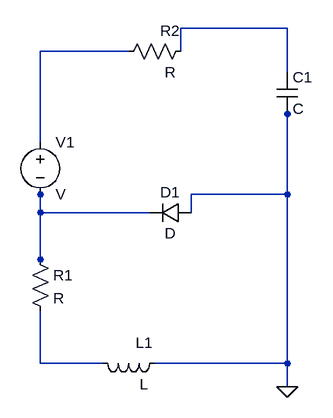
[diagram p0: schematic schematic.asc]
schematic.asc, the LTspice schematic file:
Version 4
SHEET 1 1000 750
WIRE 156 412 156 512
WIRE 156 192 156 332
WIRE 536 156 536 224
WIRE 536 288 536 708
WIRE 156 412 156 512
WIRE 156 592 156 672
WIRE 536 288 536 708
WIRE 156 672 252 672
WIRE 332 672 536 672
WIRE 156 192 292 192
WIRE 372 156 536 156
WIRE 156 440 324 440
WIRE 388 412 536 412
WIRE 372 156 372 192
WIRE 388 412 388 440
FLAG 536 708 0
SYMBOL voltage 156 316 R0
SYMATTR InstName V1
SYMBOL cap 520 224 R0
SYMATTR InstName C1
SYMBOL res 140 496 R0
SYMATTR InstName R1
SYMBOL ind 348 656 R90
WINDOW 0 0 32 VBottom 2
WINDOW 3 32 32 VTop 2
SYMATTR InstName L1
SYMBOL res 388 176 R90
WINDOW 0 0 32 VBottom 2
WINDOW 3 32 32 VTop 2
SYMATTR InstName R2
SYMBOL diode 388 424 R90
WINDOW 0 0 32 VBottom 2
WINDOW 3 32 32 VTop 2
SYMATTR InstName D1

The netlist it stands for:
* schematic.asc
V1 N002 N001 V
C1 N003 0 C
R1 N001 N004 R
L1 0 N004 L
R2 N003 N002 R
D1 0 N001 D
.model D D
.lib standard.dio
.backanno
.end